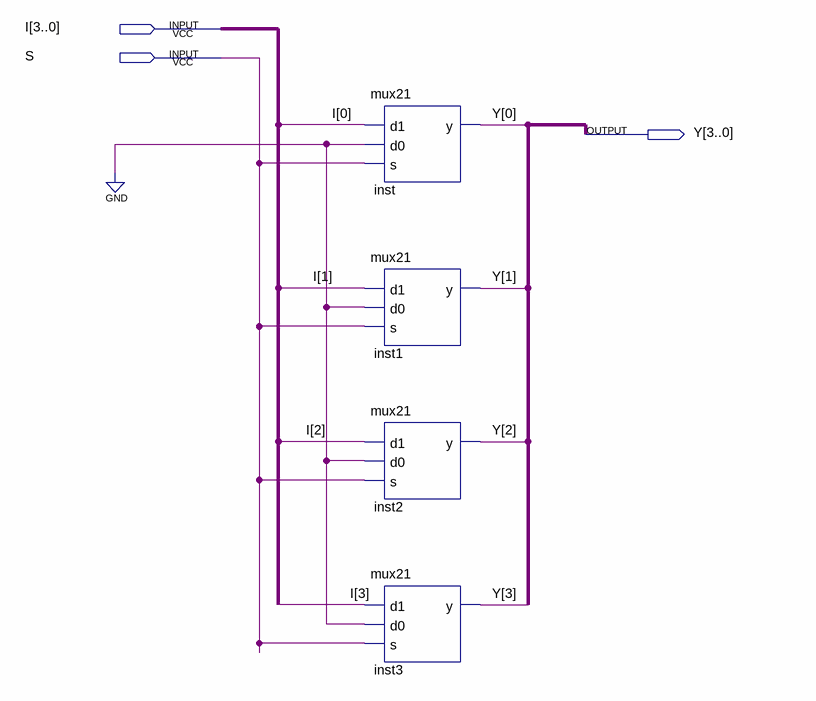
[diagram p0: schematic sheet]
// Quartus schematic selector.bdf as structural Verilog: 4 symbols, 3 pins
module selector (
  input  [3:0] I,
  input  S,
  output [3:0] Y
);

  mux21 inst (.d1(I[0]), .d0(1'b0), .s(S), .y(Y[0]));
  mux21 inst1 (.d1(I[1]), .d0(1'b0), .s(S), .y(Y[1]));
  mux21 inst2 (.d1(I[2]), .d0(1'b0), .s(S), .y(Y[2]));
  mux21 inst3 (.d1(I[3]), .d0(1'b0), .s(S), .y(Y[3]));
endmodule
